# Altium project BFO_Tester.PrjPcb
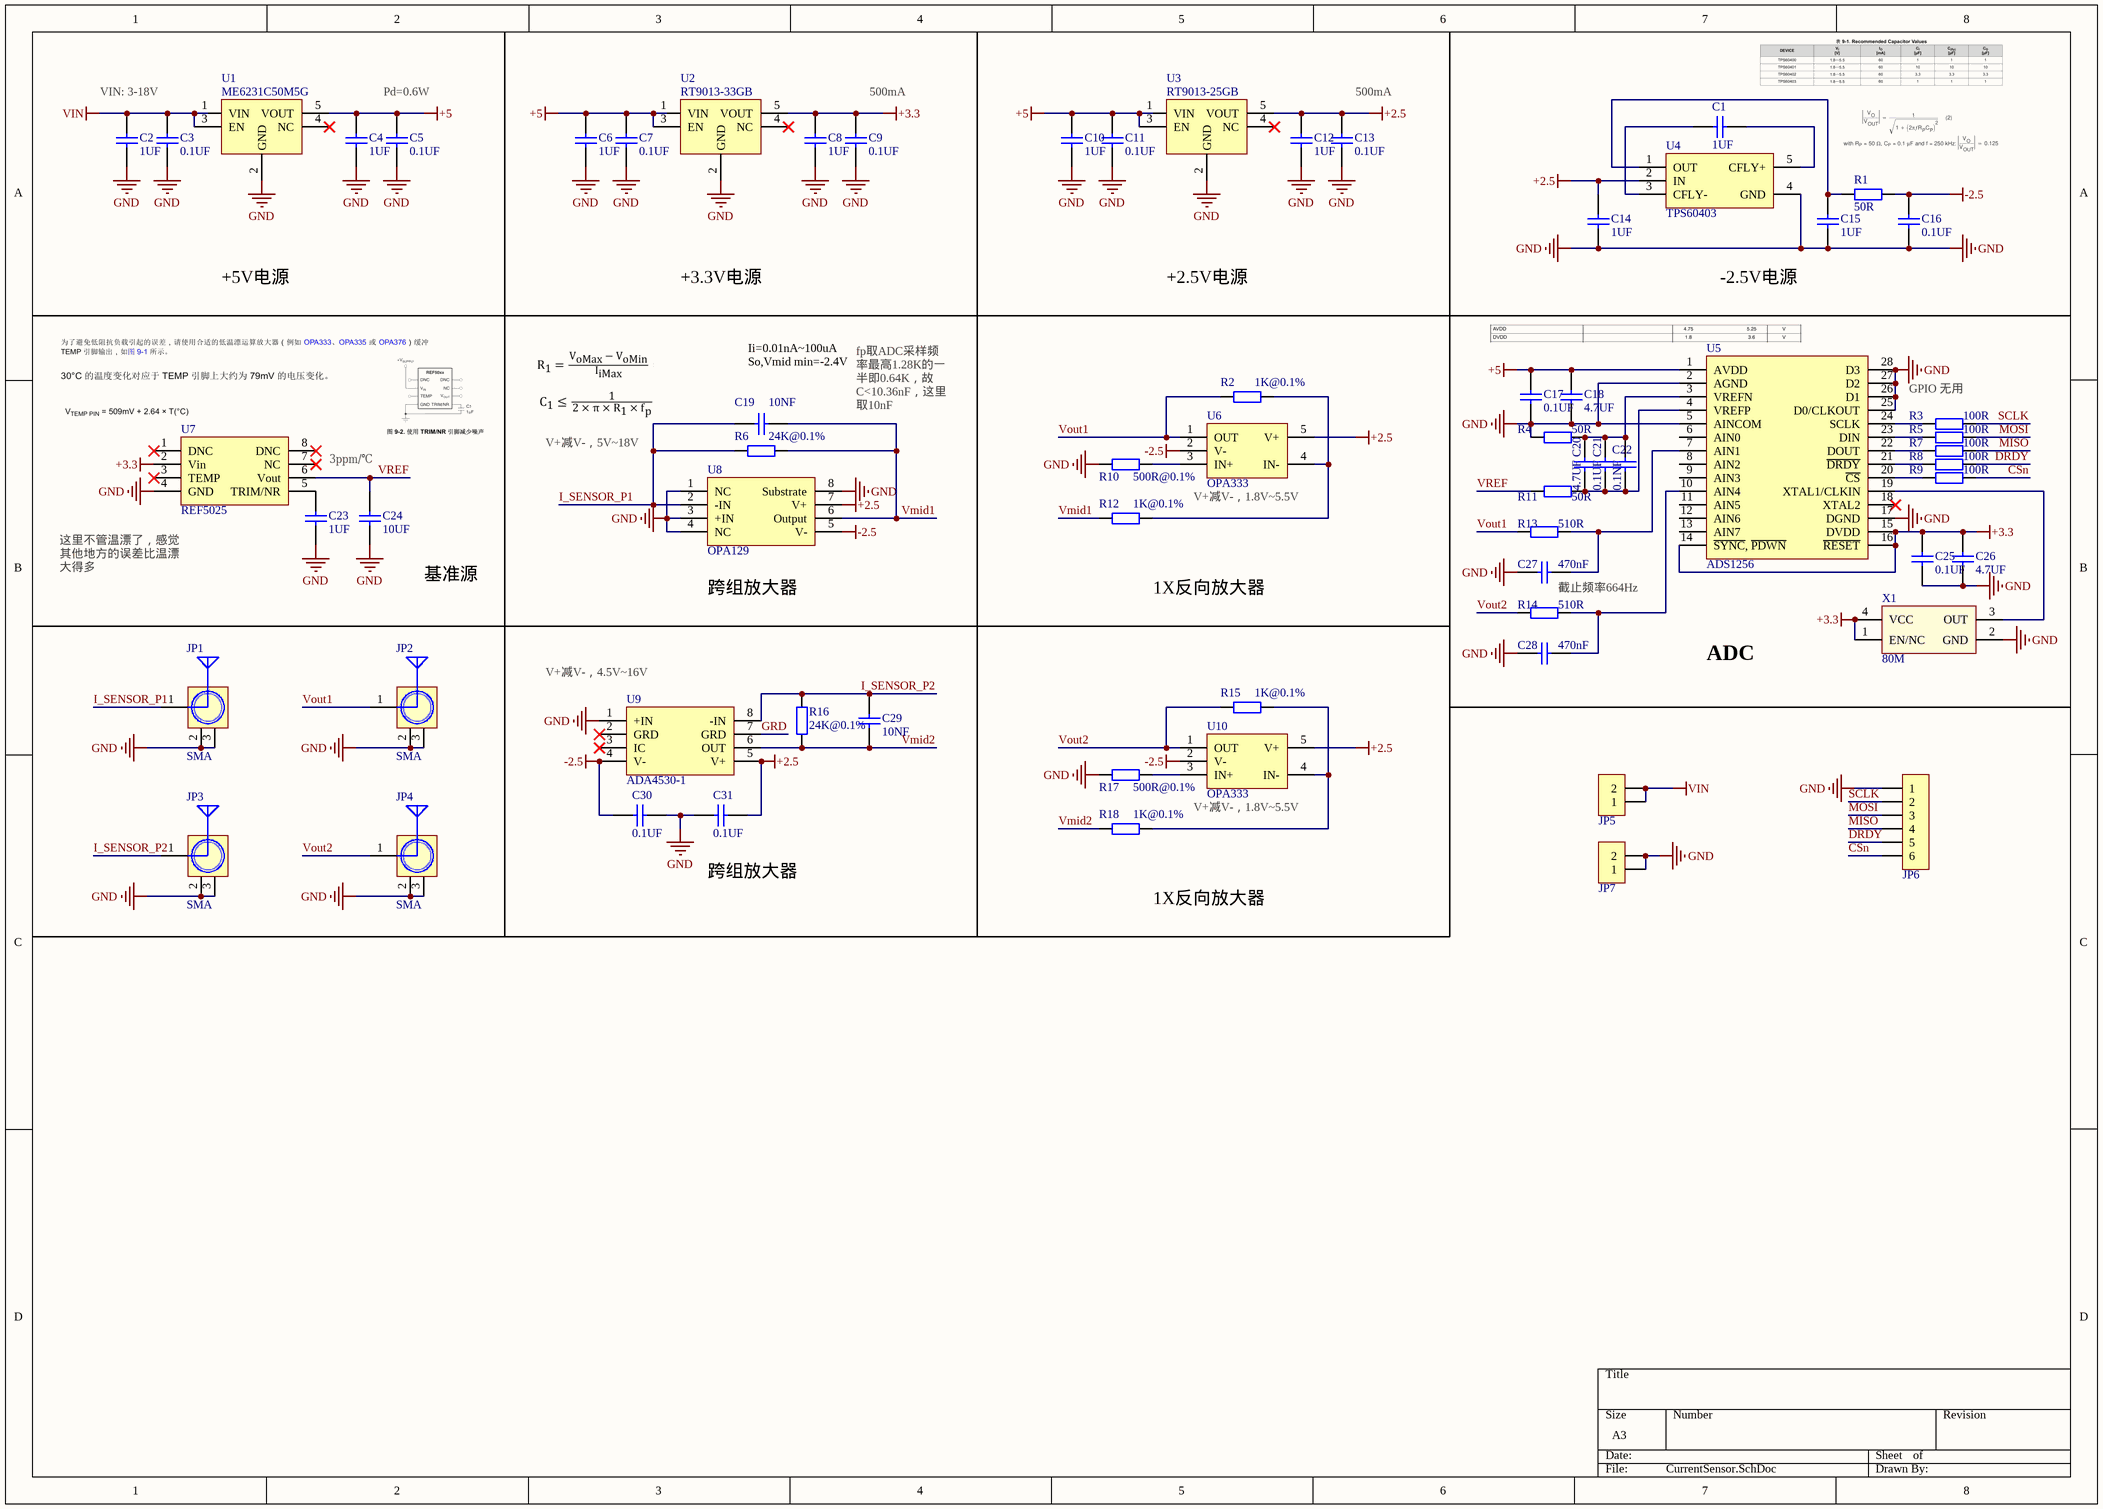
[diagram p0: CurrentSensor.SchDoc]
1 sheet, 67 parts. Net scope: global (net labels, ports and power ports of the same name join across sheets).
Board file: PCB1.PcbDoc

## Sheet CurrentSensor.SchDoc
size A3; SheetNumber: 1; SheetTotal: 1

### Parts
C1  1UF  [C0603_NS]
C2  1UF  [C0603_NS]
C3  0.1UF  [C0402_NS]
C4  1UF  [C0603_NS]
C5  0.1UF  [C0402_NS]
C6  1UF  [C0603_NS]
C7  0.1UF  [C0402_NS]
C8  1UF  [C0603_NS]
C9  0.1UF  [C0402_NS]
C10  1UF  [C0603_NS]
C11  0.1UF  [C0402_NS]
C12  1UF  [C0603_NS]
C13  0.1UF  [C0402_NS]
C14  1UF  [C0603_NS]
C15  1UF  [C0603_NS]
C16  0.1UF  [C0603_NS]
C17  0.1UF  [C0402_NS]
C18  4.7UF  [C0603_NS]
C19  10NF  [C0805_NS]
C20  4.7UF  [C0603_NS]
C21  0.1UF  [C0402_NS]
C22  0.1NF  [C0402_NS]
C23  1UF  [C0603_NS]
C24  10UF  [C0805_NS]
C25  0.1UF  [C0402_NS]
C26  4.7UF  [C0603_NS]
C27  470nF  [C0402_NS]
C28  470nF  [C0402_NS]
C29  10NF  [C0805_NS]
C30  0.1UF  [C0603_NS]
C31  0.1UF  [C0603_NS]
JP1  SMA  [SMA-KE]
JP2  SMA  [SMA-KE]
JP3  SMA  [SMA-KE]
JP4  SMA  [SMA-KE]
JP5  HDR-1X2  [HDR2.54-LI-2P]  (value not drawn)
JP6  HDR-1X6  [HDR2.54-LI-6P]  (value not drawn)
JP7  HDR-1X2  [HDR2.54-LI-2P]  (value not drawn)
R1  50R  [R0603_NS]
R2  1K@0.1%  [R0805_NS]
R3  100R  [R0402_NS]
R4  50R  [R0402_NS]
R5  100R  [R0402_NS]
R6  24K@0.1%  [R0805_NS]
R7  100R  [R0402_NS]
R8  100R  [R0402_NS]
R9  100R  [R0402_NS]
R10  500R@0.1%  [R0805_NS]
R11  50R  [R0402_NS]
R12  1K@0.1%  [R0805_NS]
R13  510R  [R0402_NS]
R14  510R  [R0402_NS]
R15  1K@0.1%  [R0805_NS]
R16  24K@0.1%  [R0805_NS]
R17  500R@0.1%  [R0805_NS]
R18  1K@0.1%  [R0805_NS]
U1  ME6231C50M5G  [SOT23-5_L3.0_W1.7_P0.95]
U2  RT9013-33GB  [SOT23-5_L3.0_W1.7_P0.95]
U3  RT9013-25GB  [SOT23-5_L3.0_W1.7_P0.95]
U4  TPS60403  [SOT23-5_L3.0_W1.7_P0.95]
U5  ADS1256  [SSOP28_L10.2_W7.8_P0.65]
U6  OPA333  [SOT23-5_L3.0_W1.7_P0.95]
U7  REF5025  [SOP8_L6.0_W5.0_P1.27]
U8  OPA129  [SOP8_L6.0_W5.0_P1.27]
U9  ADA4530-1  [SOP8_L6.0_W5.0_P1.27]
U10  OPA333  [SOT23-5_L3.0_W1.7_P0.95]
X1  80M  [OSC-3225-4P]

### Nets
+2.5: C12.2 C13.2 C14.2 C31.2 U3.5(VOUT) U4.2(IN) U6.5(V+) U8.7(V+) U9.5(V+) U10.5(V+)
+3.3: C8.2 C9.2 C25.2 C26.1 U2.5(VOUT) U5.14(~{SYNC},_~{PDWN}) U5.15(DVDD) U5.16(~{RESET}) U7.2(Vin) X1.1(EN/NC) X1.4(VCC)
+5: C4.2 C5.2 C6.2 C7.2 C10.2 C11.2 C17.2 C18.1 U1.5(VOUT) U2.1(VIN) U2.3(EN) U3.1(VIN) U3.3(EN) U5.1(AVDD)
-2.5: C16.2 C30.1 R1.2 U6.2(V-) U8.5(V-) U9.4(V-) U10.2(V-)
GND: C2.1 C3.1 C4.1 C5.1 C6.1 C7.1 C8.1 C9.1 C10.1 C11.1 C12.1 C13.1 C14.1 C15.1 C16.1 C17.1 C18.2 C23.1 C24.2 C25.1 C26.2 C27.1 C28.1 C30.2 C31.1 JP1.2(GND) JP1.3(GND) JP2.2(GND) JP2.3(GND) JP3.2(GND) JP3.3(GND) JP4.2(GND) JP4.3(GND) JP6.1 JP7.1 JP7.2 R4.2 R10.2 R17.2 U1.2(GND) U2.2(GND) U3.2(GND) U4.4(GND) U5.2(AGND) U5.5(AINCOM) U5.17(DGND) U5.25(D0/CLKOUT) U5.26(D1) U5.27(D2) U5.28(D3) U7.4(GND) U8.1(NC) U8.3(+IN) U8.4(NC) U8.8(Substrate) U9.1(+IN) X1.2(GND)
VIN: C2.2 C3.2 JP5.1 JP5.2 U1.1(VIN) U1.3(EN)
CSn: JP6.6 R9.1
DRDY: JP6.5 R8.1
GRD: U9.7(GRD)
I_SENSOR_P1: C19.1 JP1.1(ANT) R6.2 U8.2(-IN)
I_SENSOR_P2: C29.2 JP3.1(ANT) R16.1 U9.8(-IN)
MISO: JP6.4 R7.1
MOSI: JP6.3 R5.1
SCLK: JP6.2 R3.1
Vmid1: C19.2 R6.1 R12.2 U8.6(Output)
Vmid2: C29.1 R16.2 R18.2 U9.6(OUT)
Vout1: JP2.1(ANT) R2.2 R13.2 U6.1(OUT)
Vout2: JP4.1(ANT) R14.2 R15.2 U10.1(OUT)
VREF: C24.1 R11.2 U7.6(Vout)
NetC1_1: C1.1 U4.5(CFLY+)
NetC1_2: C1.2 U4.3(CFLY-)
NetC15_2: C15.2 R1.1 U4.1(OUT)
NetC20_1: C20.1 C21.1 C22.1 R4.1 U5.3(VREFN)
NetC20_2: C20.2 C21.2 C22.2 R11.1 U5.4(VREFP)
NetC23_2: C23.2 U7.5(TRIM/NR)
NetC27_2: C27.2 R13.1 U5.7(AIN1)
NetC28_2: C28.2 R14.1 U5.10(AIN4)
NetR2_1: R2.1 R12.1 U6.4(IN-)
NetR3_2: R3.2 U5.24(SCLK)
NetR5_2: R5.2 U5.23(DIN)
NetR7_2: R7.2 U5.22(DOUT)
NetR8_2: R8.2 U5.21(~{DRDY})
NetR9_2: R9.2 U5.20(~{CS})
NetR10_1: R10.1 U6.3(IN+)
NetR15_1: R15.1 R18.1 U10.4(IN-)
NetR17_1: R17.1 U10.3(IN+)
NetU5_19: U5.19(XTAL1/CLKIN) X1.3(OUT)

Not connected (* = marked no-connect by the designer): U1 4(NC)*; U2 4(NC)*; U3 4(NC)*; U5 6(AIN0) 8(AIN2) 9(AIN3) 11(AIN5) 12(AIN6) 13(AIN7) 18(XTAL2)*; U7 1(DNC)* 3(TEMP)* 7(NC)* 8(DNC)*; U9 2(GRD)* 3(IC)*

### Notes on the sheet
- VIN: 3-18V
- Pd=0.6W
- (near C9) 500mA
- (near C13) 500mA
- +5V电源
- +3.3V电源
- +2.5V电源
- -2.5V电源
- Ii=0.01nA~100uA
- So,Vmid min=-2.4V
- V+减V-，5V~18V
- fp取ADC采样频率最高1.28K的一半即0.64K，故C<10.36nF，这里取10nF
- GPIO 无用
- 3ppm/℃
- (near U6) V+减V-，1.8V~5.5V
- (near U7) 这里不管温漂了，感觉其他地方的误差比温漂大得多
- 基准源
- (near U8) 跨组放大器
- 1X反向放大器
- 截止频率664Hz
- (near U9) V+减V-，4.5V~16V
- ADC
- (near U10) V+减V-，1.8V~5.5V
- (near C31) 跨组放大器

### Library data of the parts
C1-C31 = C: 贴片电容/MLCC电容; BOM名称: MLCC
JP1-JP4 = SMA: SMA-2.4G射频天线接口; BOM名称: SMA-2.4G射频天线接口
JP5 JP7 = Header 2: 2P接插件; BOM名称: 2P接插件
JP6 = Header 6: 6P接插件; BOM名称: 6P接插件
R1-R18 = R: 贴片电阻; BOM名称: 贴片电阻
U1-U3 = RT9013-33GB: 500mA 低压差, 低噪声, 超快速线性稳压器
U4 = TPS60403: 具有固定 250kHz 操作的 60mA 电荷泵电压反向器
U5 = ADS1256: 适用于工厂自动化和过程控制且具有 PGA 的 24 位、30kSPS、8 通道 Δ-Σ ADC
U6 U10 = OPA333: 1.8V、17µA、微功耗、精密、零漂移 CMOS 运算放大器
U7 = REF50XX: 2.5V、3µVpp/V 噪声、3ppm/°C 温漂、精密串联电压基准
U8 = OPA129: 超低偏置电流差动运算放大器
U9 = ADA4530-1: 微微安输入偏置电流静电计放大器
X1 = XTAL-ACT-4P: 4脚有源晶振(振荡器); BOM名称: 有源晶振(振荡器)